# Altium schematic sheet PowerSupply.SchDoc
size A; SheetNumber: 2; SheetTotal: 4
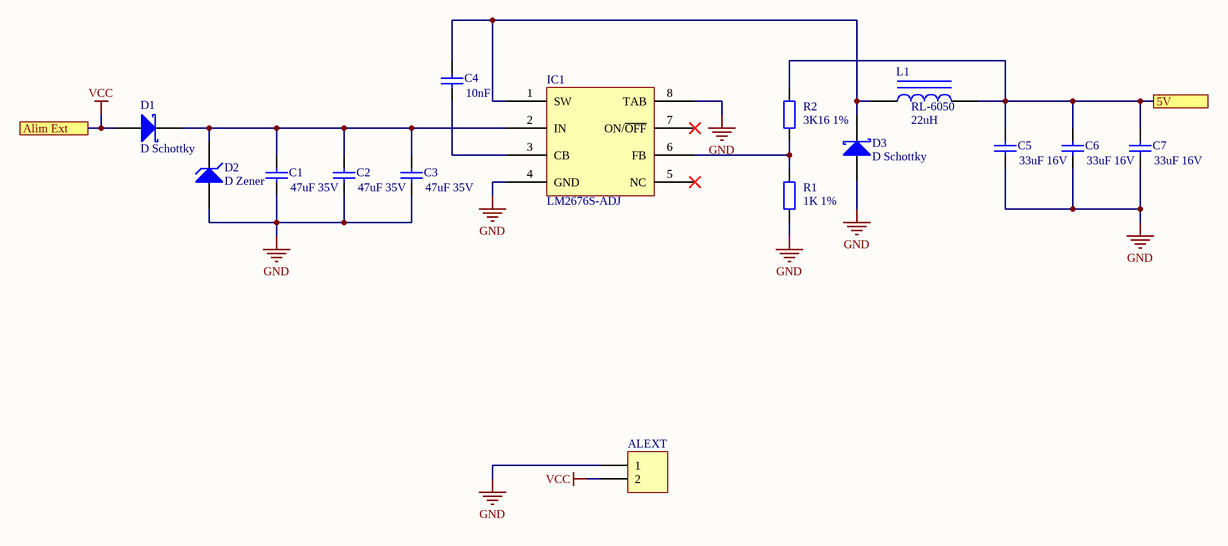
[diagram p0: PowerSupply.SchDoc]

## Parts
ALEXT  Header 2  [CONN HEADER VERT 2POS 3.96MM]  (value not drawn)
C1  value 47uF 35V  [KEMET Case D]  (hidden comment: Cap)
C2  value 47uF 35V  [KEMET Case D]  (hidden comment: Cap)
C3  value 47uF 35V  [KEMET Case D]  (hidden comment: Cap)
C4  value 10nF  [RES0805]  (hidden comment: Cap)
C5  value 33uF 16V  [RES 1206]  (hidden comment: Cap)
C6  value 33uF 16V  [RES 1206]  (hidden comment: Cap)
C7  value 33uF 16V  [RES 1206]  (hidden comment: Cap)
D1  D Schottky  [SMB]
D2  D Zener  [SMB]
D3  D Schottky  [SMB]
IC1  LM2676S-ADJ  [DPAK127P1435X464-8N]
L1  RL-6050  value 22uH  [RL-6050]
R1  value 1K 1%  [RES0805]  (hidden comment: Res2)
R2  value 3K16 1%  [RES0805]  (hidden comment: Res2)

## Ports
5V, Alim Ext

## Nets
GND: ALEXT.1 C1.2 C2.2 C3.2 C5.1 C6.1 C7.1 D2.1(A) D3.1(A) IC1.4(GND) IC1.8(TAB) R1.1
VCC: ALEXT.2 D1.1(A) ; port Alim Ext
5V: C5.2 C6.2 C7.2 L1.2 R2.2 ; port 5V
NetC1_1: C1.1 C2.1 C3.1 D1.2(K) D2.2(K) IC1.2(IN)
NetC4_1: C4.1 IC1.3(CB)
NetC4_2: C4.2 D3.2(K) IC1.1(SW) L1.1
NetIC1_6: IC1.6(FB) R1.2 R2.1

Not connected (* = marked no-connect by the designer): IC1 5(NC)* 7(ON/~{OFF})*

## Library data of the parts
ALEXT = Header 2: Header, 2-Pin; LatestRevisionDate: 17-Jul-2002; LatestRevisionNote: Re-released for DXP Platform.; Publisher: Altium Limited
C1-C7 = Cap: Capacitor; Published: 8-Jun-2000; LatestRevisionDate: 17-Jul-2002; LatestRevisionNote: Re-released for DXP Platform.; Publisher: Altium Limited
  C1-C3: PackageReference: SMD,D6.3xL5.4mm; PackageDescription: SMD,D6.3xL5.4mm; LCSC Part #: C110229
  C4: PackageReference: 0805; PackageDescription: 0805; LCSC Part #: C1710
  C5-C7: PackageReference: 1206; PackageDescription: 1206
D1 D3 = D Schottky: B340B-13-F; Published: 8-Jun-2000; LatestRevisionDate: 17-Jul-2002; LatestRevisionNote: Re-released for DXP Platform.; PackageReference: SMB; Publisher: Altium Limited; PackageDescription: DO-214-AA/SMB; 2 C-Bend Leads; Body 5.3 x 3.6 mm, inc. leads (LxW); LCSC Part #: C85099; Value: B340B-13-F
D2 = D Zener: SMBJ24A; Published: 8-Jun-2000; LatestRevisionDate: 17-Jul-2002; LatestRevisionNote: Re-released for DXP Platform.; PackageReference: SMB; Publisher: Altium Limited; PackageDescription: DO-214-AA/SMB; 2 C-Bend Leads; Body 5.3 x 3.6 mm, inc. leads (LxW); LCSC Part #: C3018876; Value: SMBJ24A
IC1 = LM2676S-ADJ: The LM2676 series of regulators are monolithic / integrated circuits which provide all of the active / functions for a step-down (buck) switching regulator / capable of driving up to 3-A loads with excellent line / and load regulation characteristics.; Datasheet: https://www.ti.com/lit/ds/symlink/lm2676.pdf?HQS=dis-dk-null-digikeymode-dsf-pf-null-wwe&ts=1689865044741&ref_url=https%253A%252F%252Fwww.ti.com%252Fgeneral%252Fdocs%252Fsuppproductinfo.tsp%253FdistId%253D10%2526gotoUrl%253Dhttps%253A%252F%252Fwww.ti.com%252Flit%252Fgpn%252Flm2676
L1 = Inductor Iron: Magnetic-Core Inductor; Published: 24-Mar-1999; LatestRevisionDate: 17-Jul-2002; LatestRevisionNote: Re-released for DXP Platform.; PackageReference: AXIAL-0.9; Publisher: Altium Limited; PackageDescription: Axial Device, Thru-Hole; 2 Leads; 0.9 in Pin Spacing
R1 R2 = Res2: Resistor; Published: 8-Jun-2000; LatestRevisionDate: 17-Jul-2002; LatestRevisionNote: Re-released for DXP Platform.; PackageReference: 0805; Publisher: Altium Limited; PackageDescription: 0805
  R1: LCSC Part #: C416040
  R2: LCSC Part #: C170878